# Altium schematic sheet MdA_Power.SchDoc: **
size A4; ENG_APP_DATE: --/--/--; DSN_APP_DATE: --/--/--; CHK_APP_DATE: --/--/--; Author: **; CompanyName: Introducción al Diseño de Circuitos Impresos; Organization: UTN FRBA; Revision: **; SheetNumber: 1; SheetTotal: 4
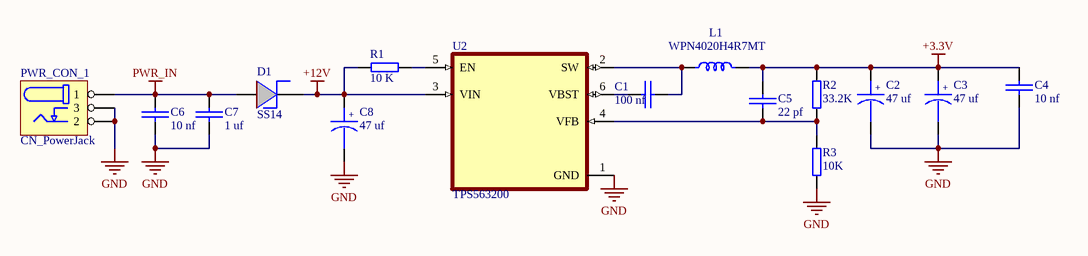
[diagram p0: MdA_Power.SchDoc]

## Parts
C1  100 nf  [C_0402]
C2  47 uf  [C_P_1210]
C3  47 uf  [C_P_1210]
C4  10 nf  [C_0603]
C5  22 pf  [C_0402]
C6  10 nf  [C_0402]
C7  1 uf  [C_0603]
C8  47 uf  [C_P_1210]
D1  SS14  [D_SMA]
L1  WPN4020H4R7MT  [IFSC1515AH]
PWR_CON_1  CN_PowerJack  [PJ002B]
R1  10 K  [R_0402]
R2  33.2K  [R_0402]
R3  10K  [R_0402]
U2  TPS563200  [SOT-23-6]

## Nets
+3.3V: C2.1 C3.1 C4.2 C5.1 L1.2 R2.2
+12V: C8.1 D1.2(K) R1.2 U2.3(VIN)
GND: C2.2 C3.2 C4.1 C6.2 C7.2 C8.2 PWR_CON_1.2 PWR_CON_1.3 R3.1 U2.1(GND)
PWR_IN: C6.1 C7.1 D1.1(A) PWR_CON_1.1
NetC1_1: C1.1 U2.6(VBST)
NetC1_2: C1.2 L1.1 U2.2(SW)
NetC5_2: C5.2 R2.1 R3.2 U2.4(VFB)
NetR1_1: R1.1 U2.5(EN)

## Notes on the sheet
- Title:
- Size:
- Author:
- A4
- Sheet
- of
- Revision:
- File:
- Date:
- (in symbol CAP_P) +

## Library data of the parts
C1 C4-C7 = CAP
  C6: LCSC PArt Number: *
C2 C3 C8 = CAP_P
D1 = DIODE_SH
L1 = IND
R1-R3 = RES